# Altium schematic sheet PAGE1 - CONTENTS.SchDoc
size A3; DocumentNumber: 1; SheetNumber: 1; SheetTotal: 2
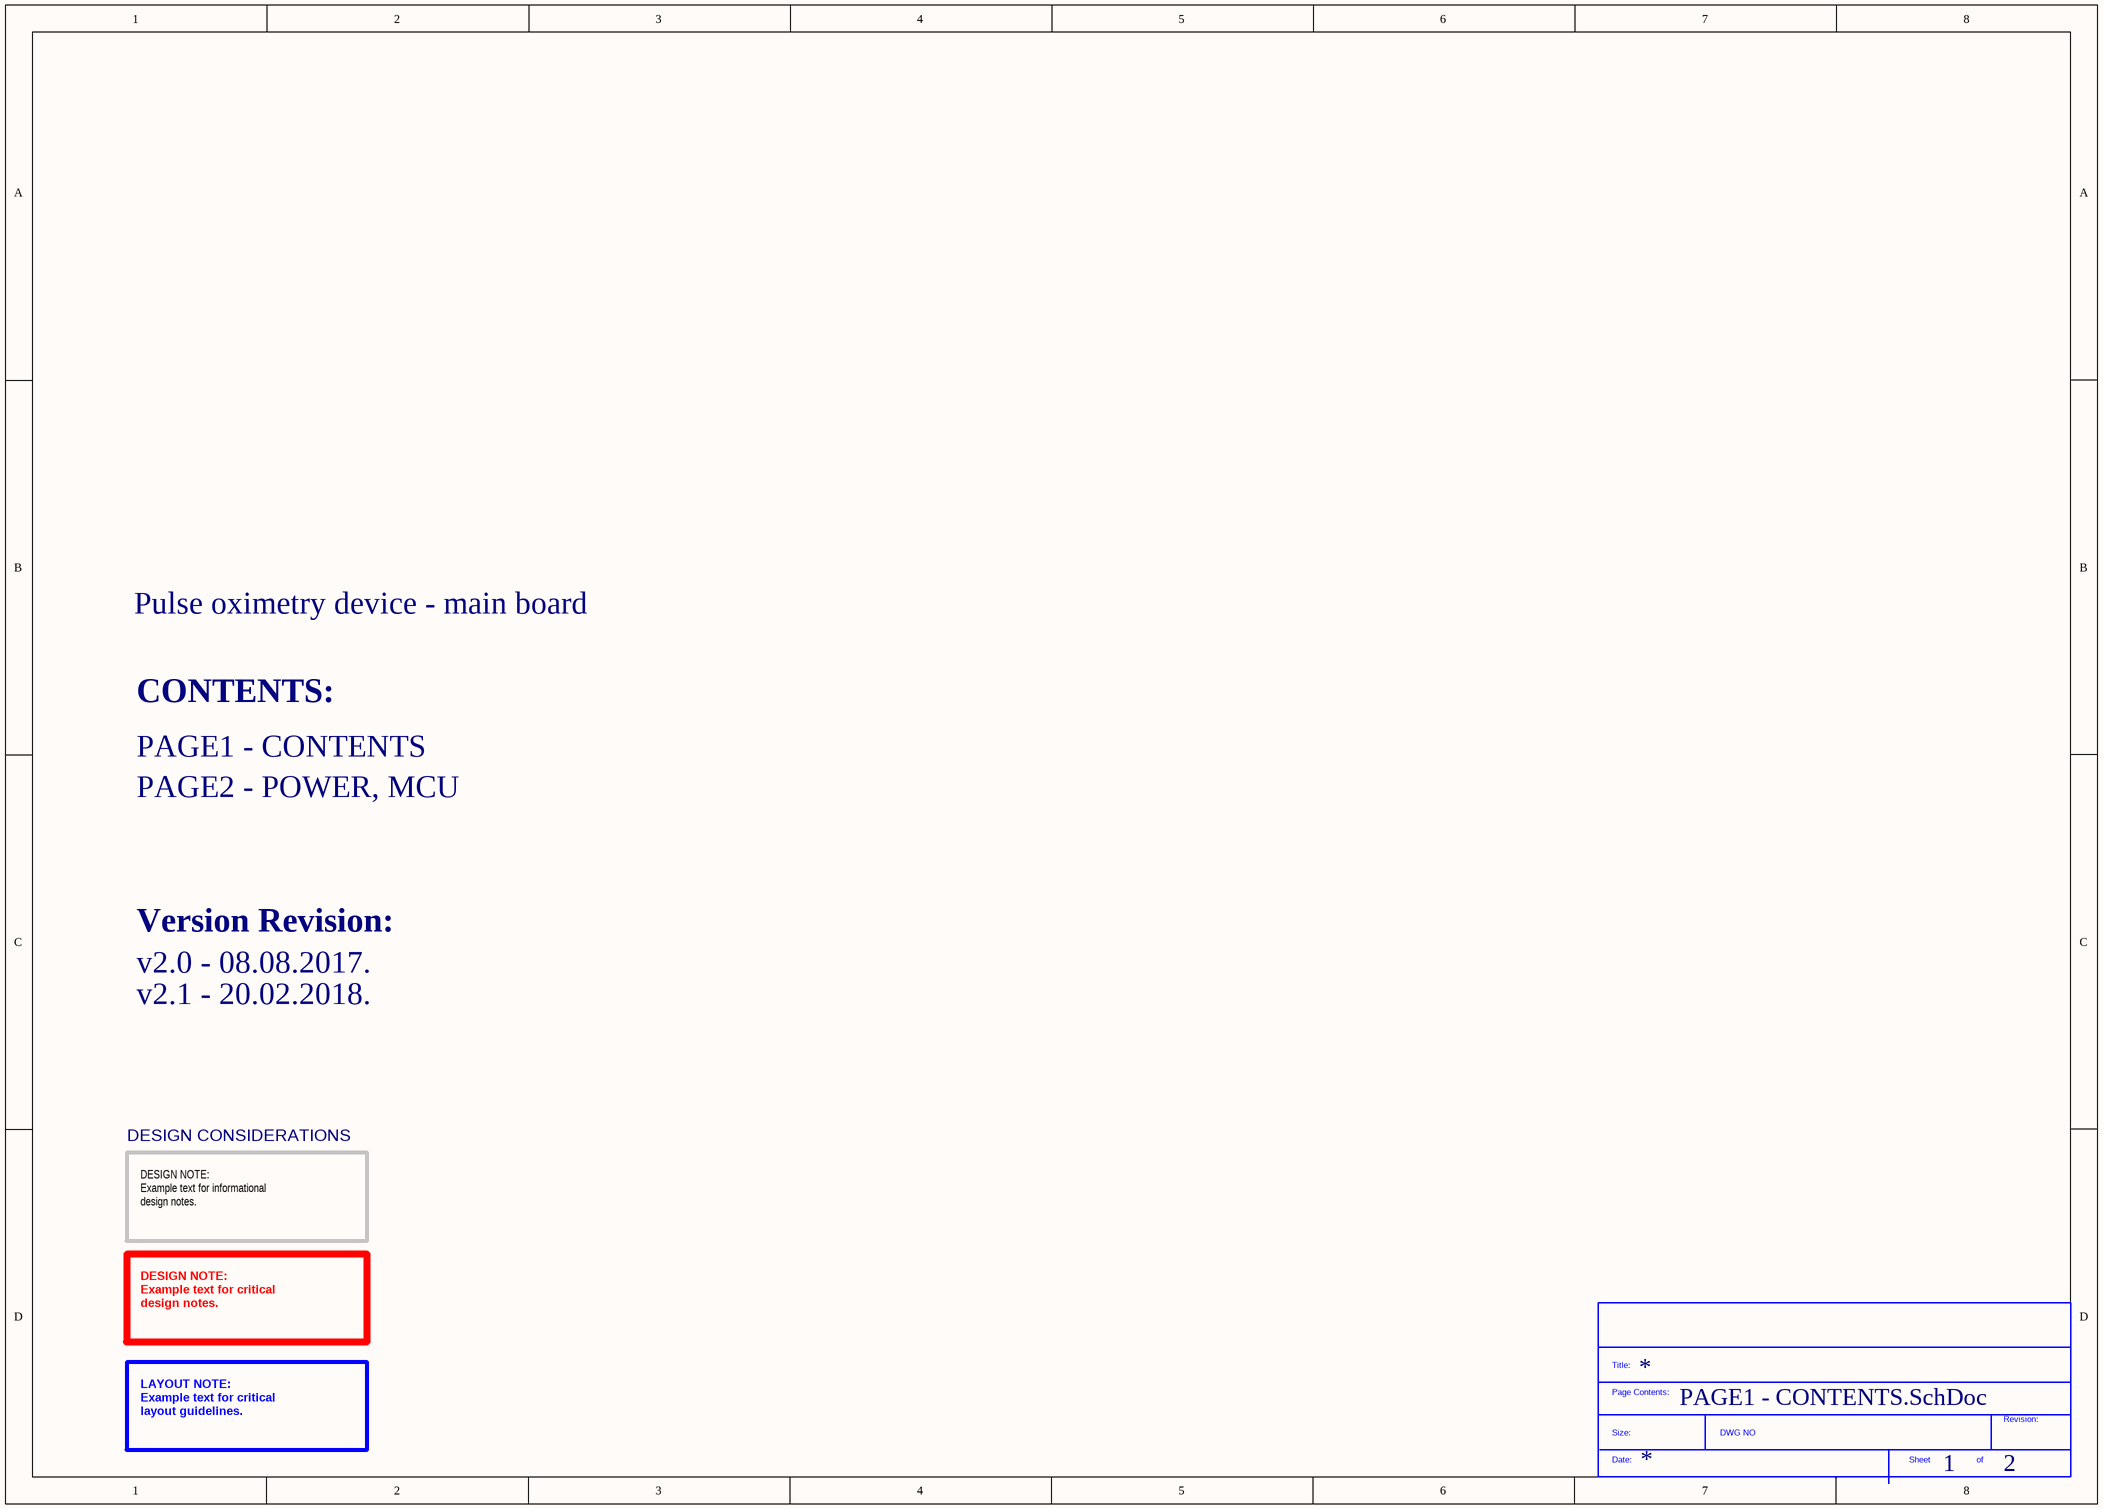
[diagram p0: PAGE1 - CONTENTS.SchDoc]

## Parts
*?  SDTitleBlock  (value not drawn)  (graphical)

## Notes on the sheet
- Pulse oximetry device - main board
- CONTENTS:
- PAGE1 - CONTENTS
- PAGE2 - POWER, MCU
- Version Revision:
- v2.0 - 08.08.2017.
- v2.1 - 20.02.2018.
- DESIGN CONSIDERATIONS
- DESIGN NOTE:
  Example text for informational
  design notes.
- DESIGN NOTE:
  Example text for critical
  design notes.
- LAYOUT NOTE:
  Example text for critical
  layout guidelines.
- (in symbol SDTitleBlock) Title:; Page Contents:; Revision:; Size:; DWG NO; Date:; Sheet; of